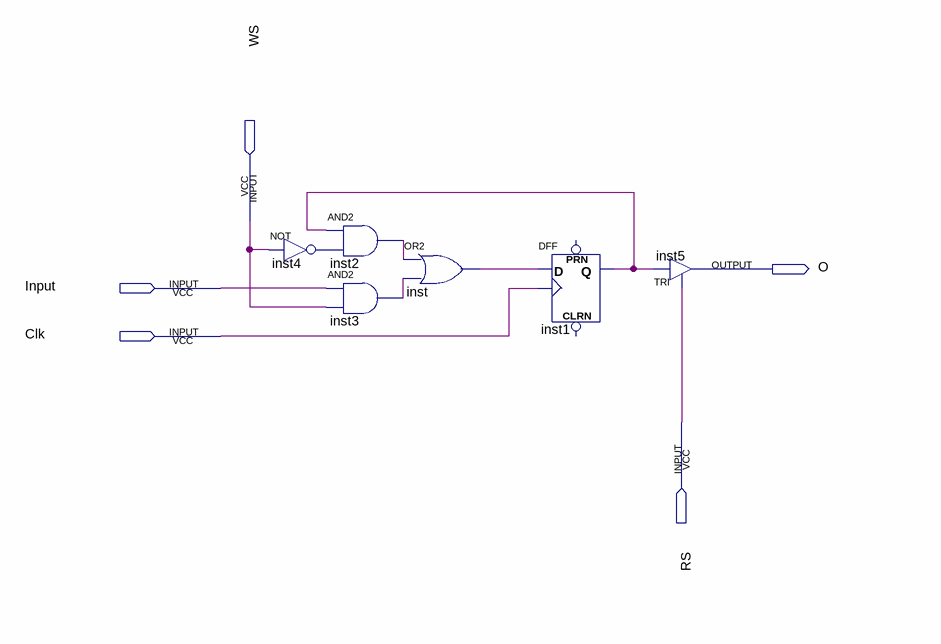
[diagram p0: schematic sheet]
// Quartus schematic RFC_Mono.bdf as structural Verilog: 6 symbols, 5 pins
module RFC_Mono (
  input  WS,
  input  Input,
  input  Clk,
  input  RS,
  output O
);

  wire inst1_q, inst2_out, inst3_out, inst4_out, inst_out;

  not inst4 (inst4_out, WS);
  and inst2 (inst2_out, inst1_q, inst4_out);
  and inst3 (inst3_out, Input, WS);
  or inst (inst_out, inst2_out, inst3_out);
  DFF inst1 (.CLK(Clk), .D(inst_out), .Q(inst1_q));  // open: CLRN, PRN
  TRI inst5 (.IN(inst1_q), .OE(RS), .OUT(O));
endmodule
